# EasyEDA Pro project stm_boy_proj.epro, schematic gameconsole

## Sheets
1 Logic: Board Name: gameconsole; Create Date: 2026-05-28; Page Name: Logic; Schematic Name: gameconsole; Update Date: 2026-05-31
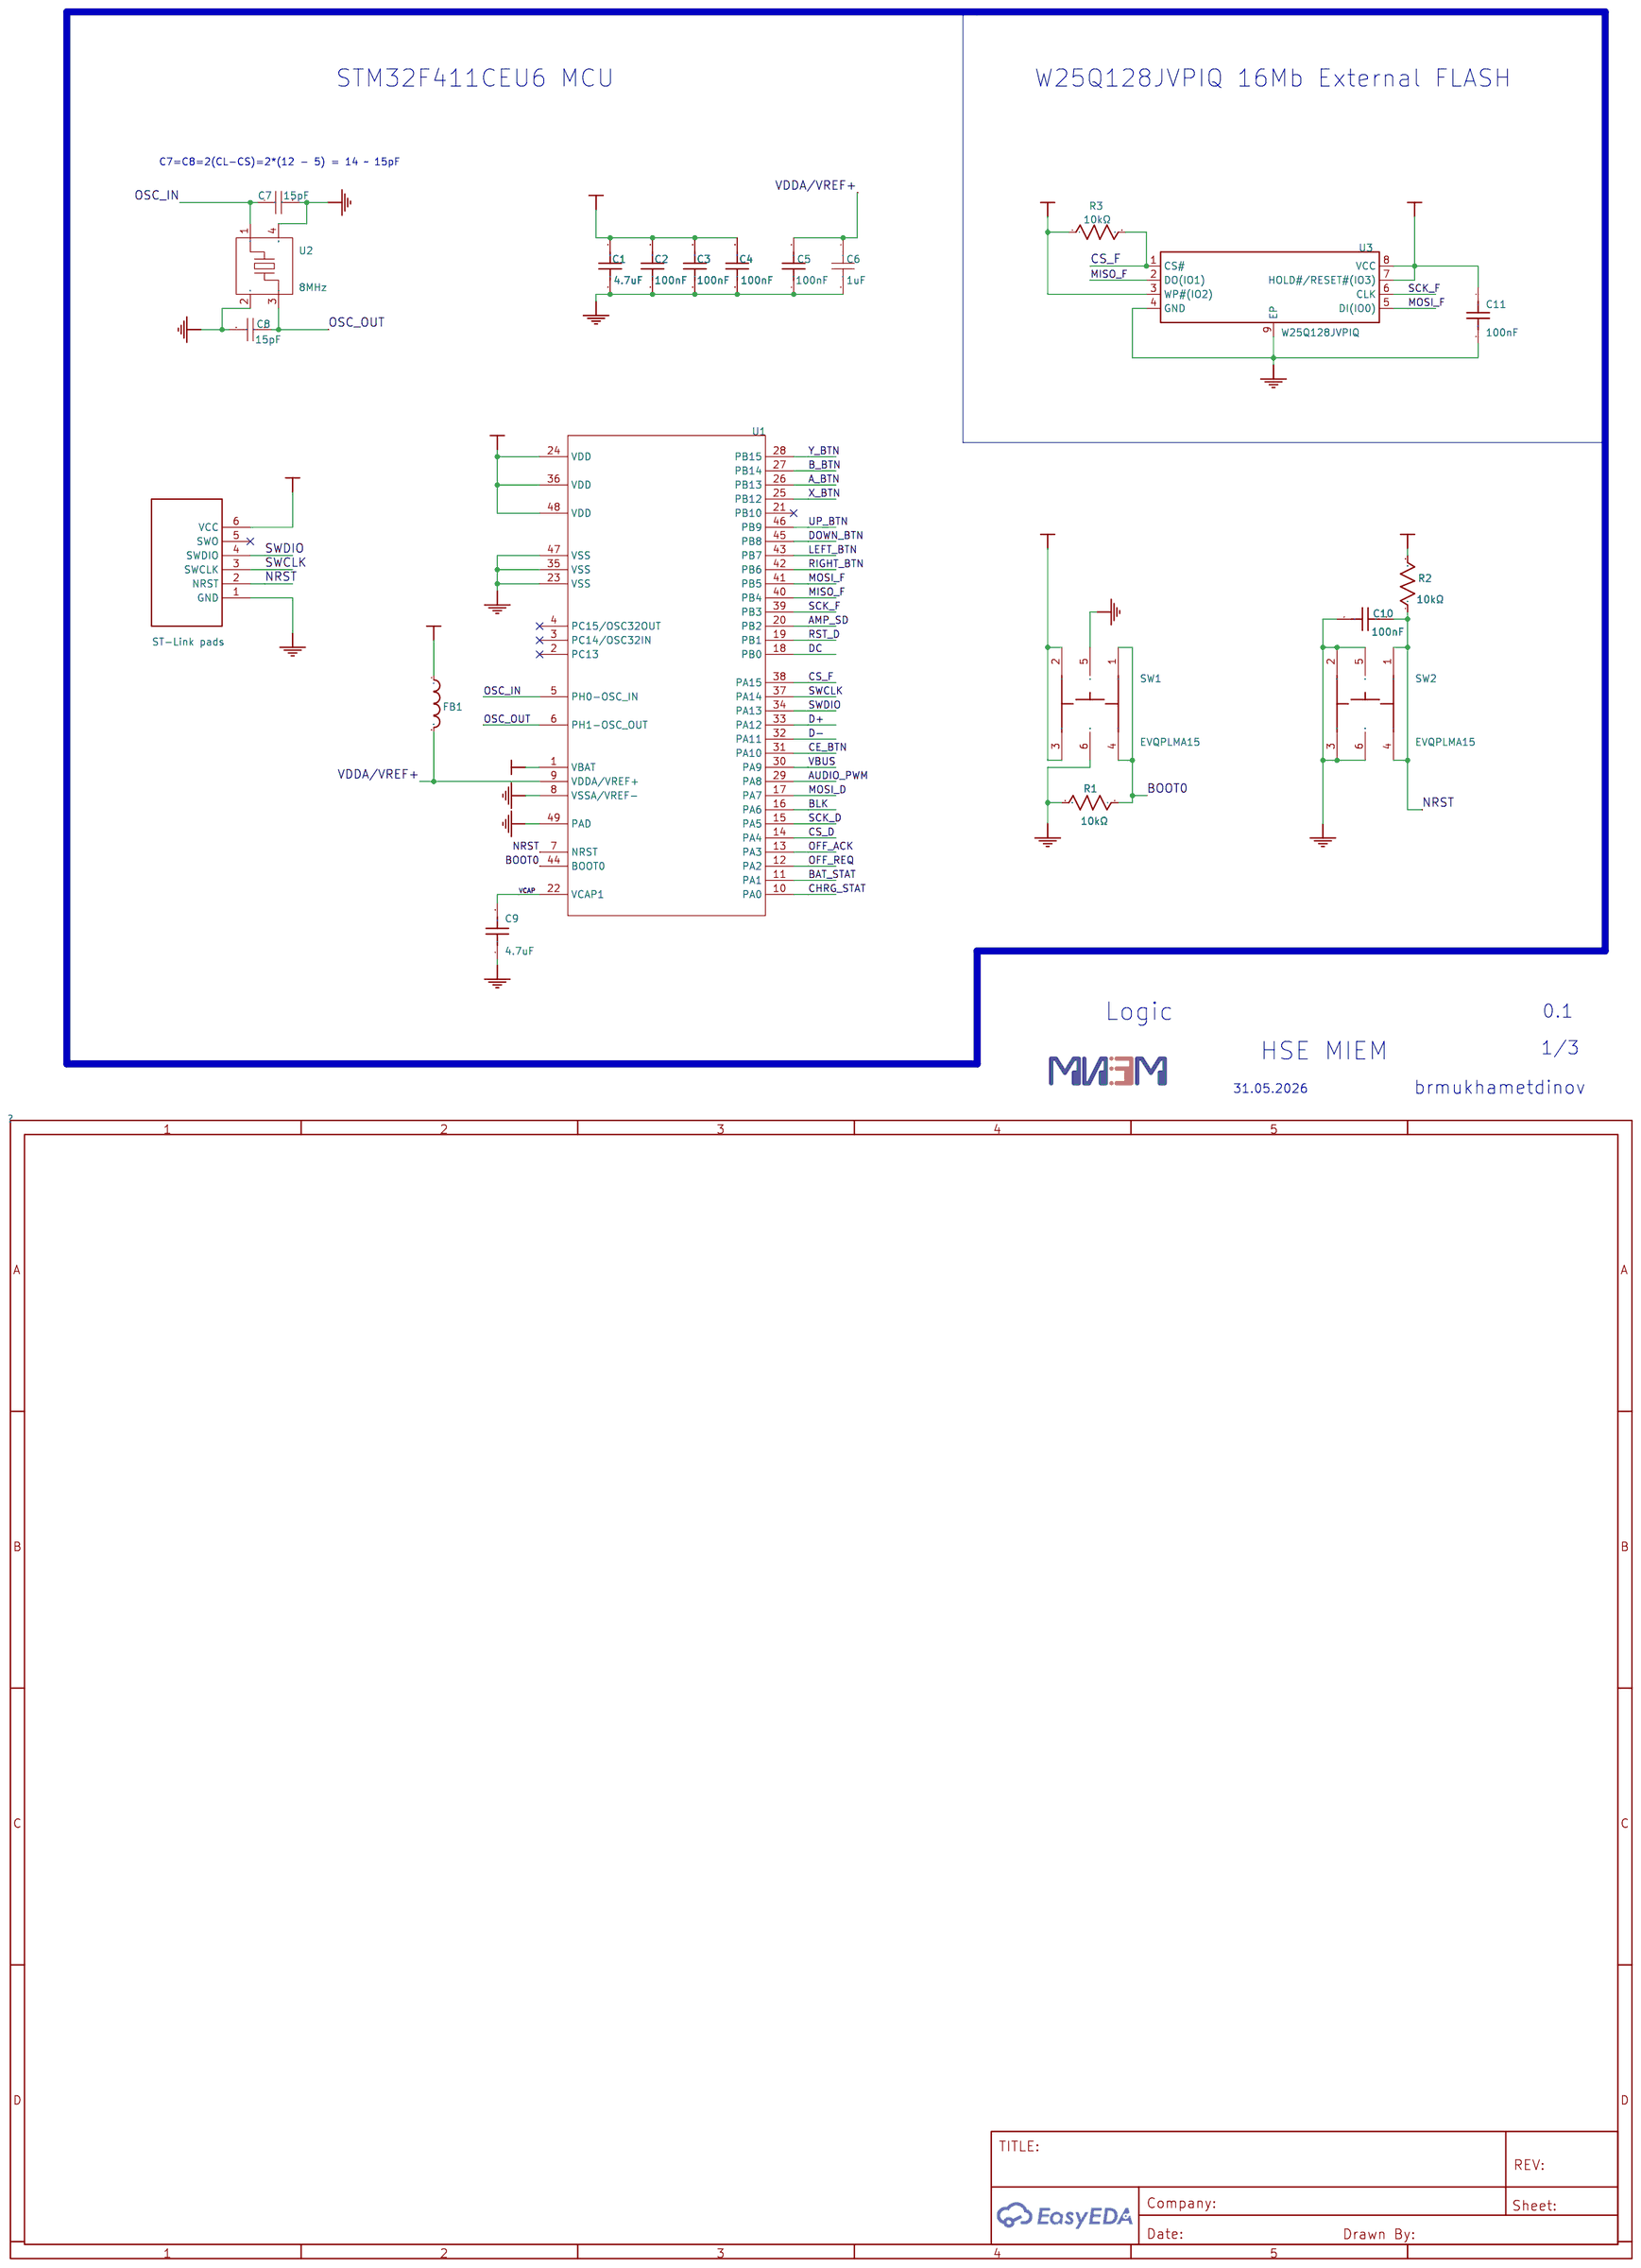
[diagram p0: Logic]
2 Power supply: Page Name: Power supply
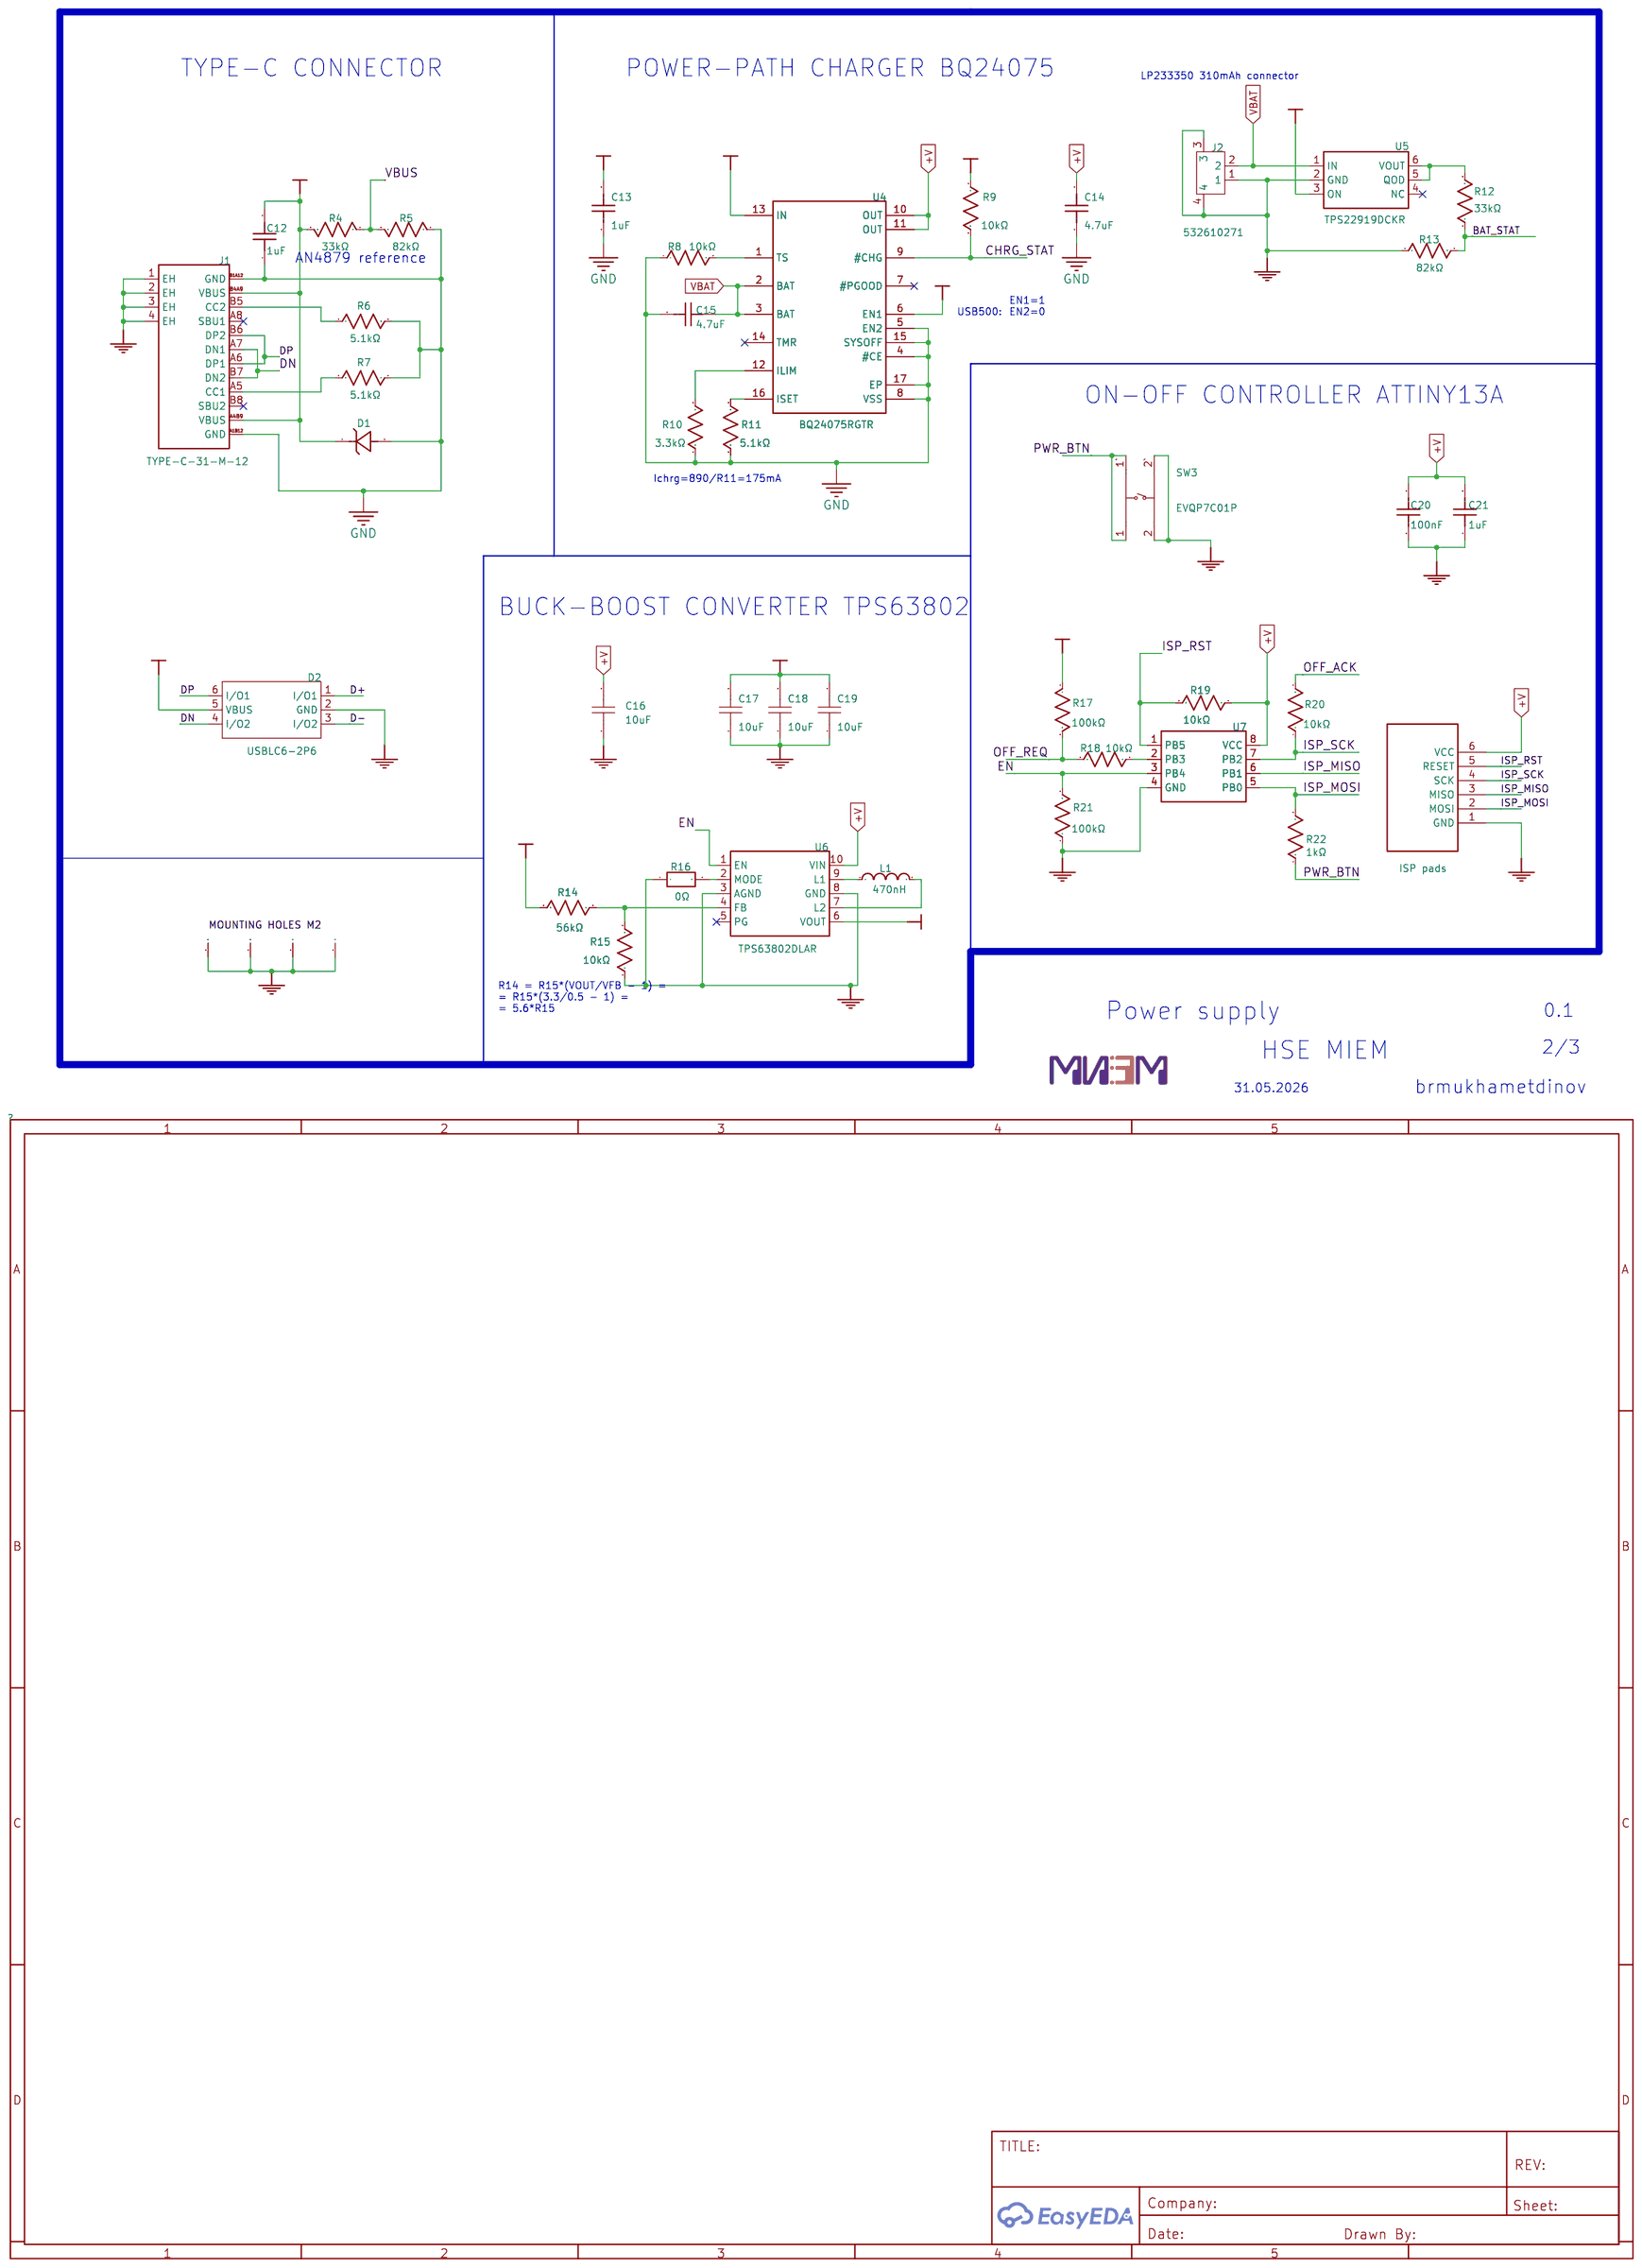
[diagram p1: Power supply]
3 Input/Output interfaces: Page Name: Input/Output interfaces; Project Name: gameconsole_2026-05-14_18-13-52; Add into BOM: yes; Company: HSE; Convert to PCB: yes; Date: 2026-04-27; Draw By: brmukhametdinov; REV: 0.5; Sheet: 1/4
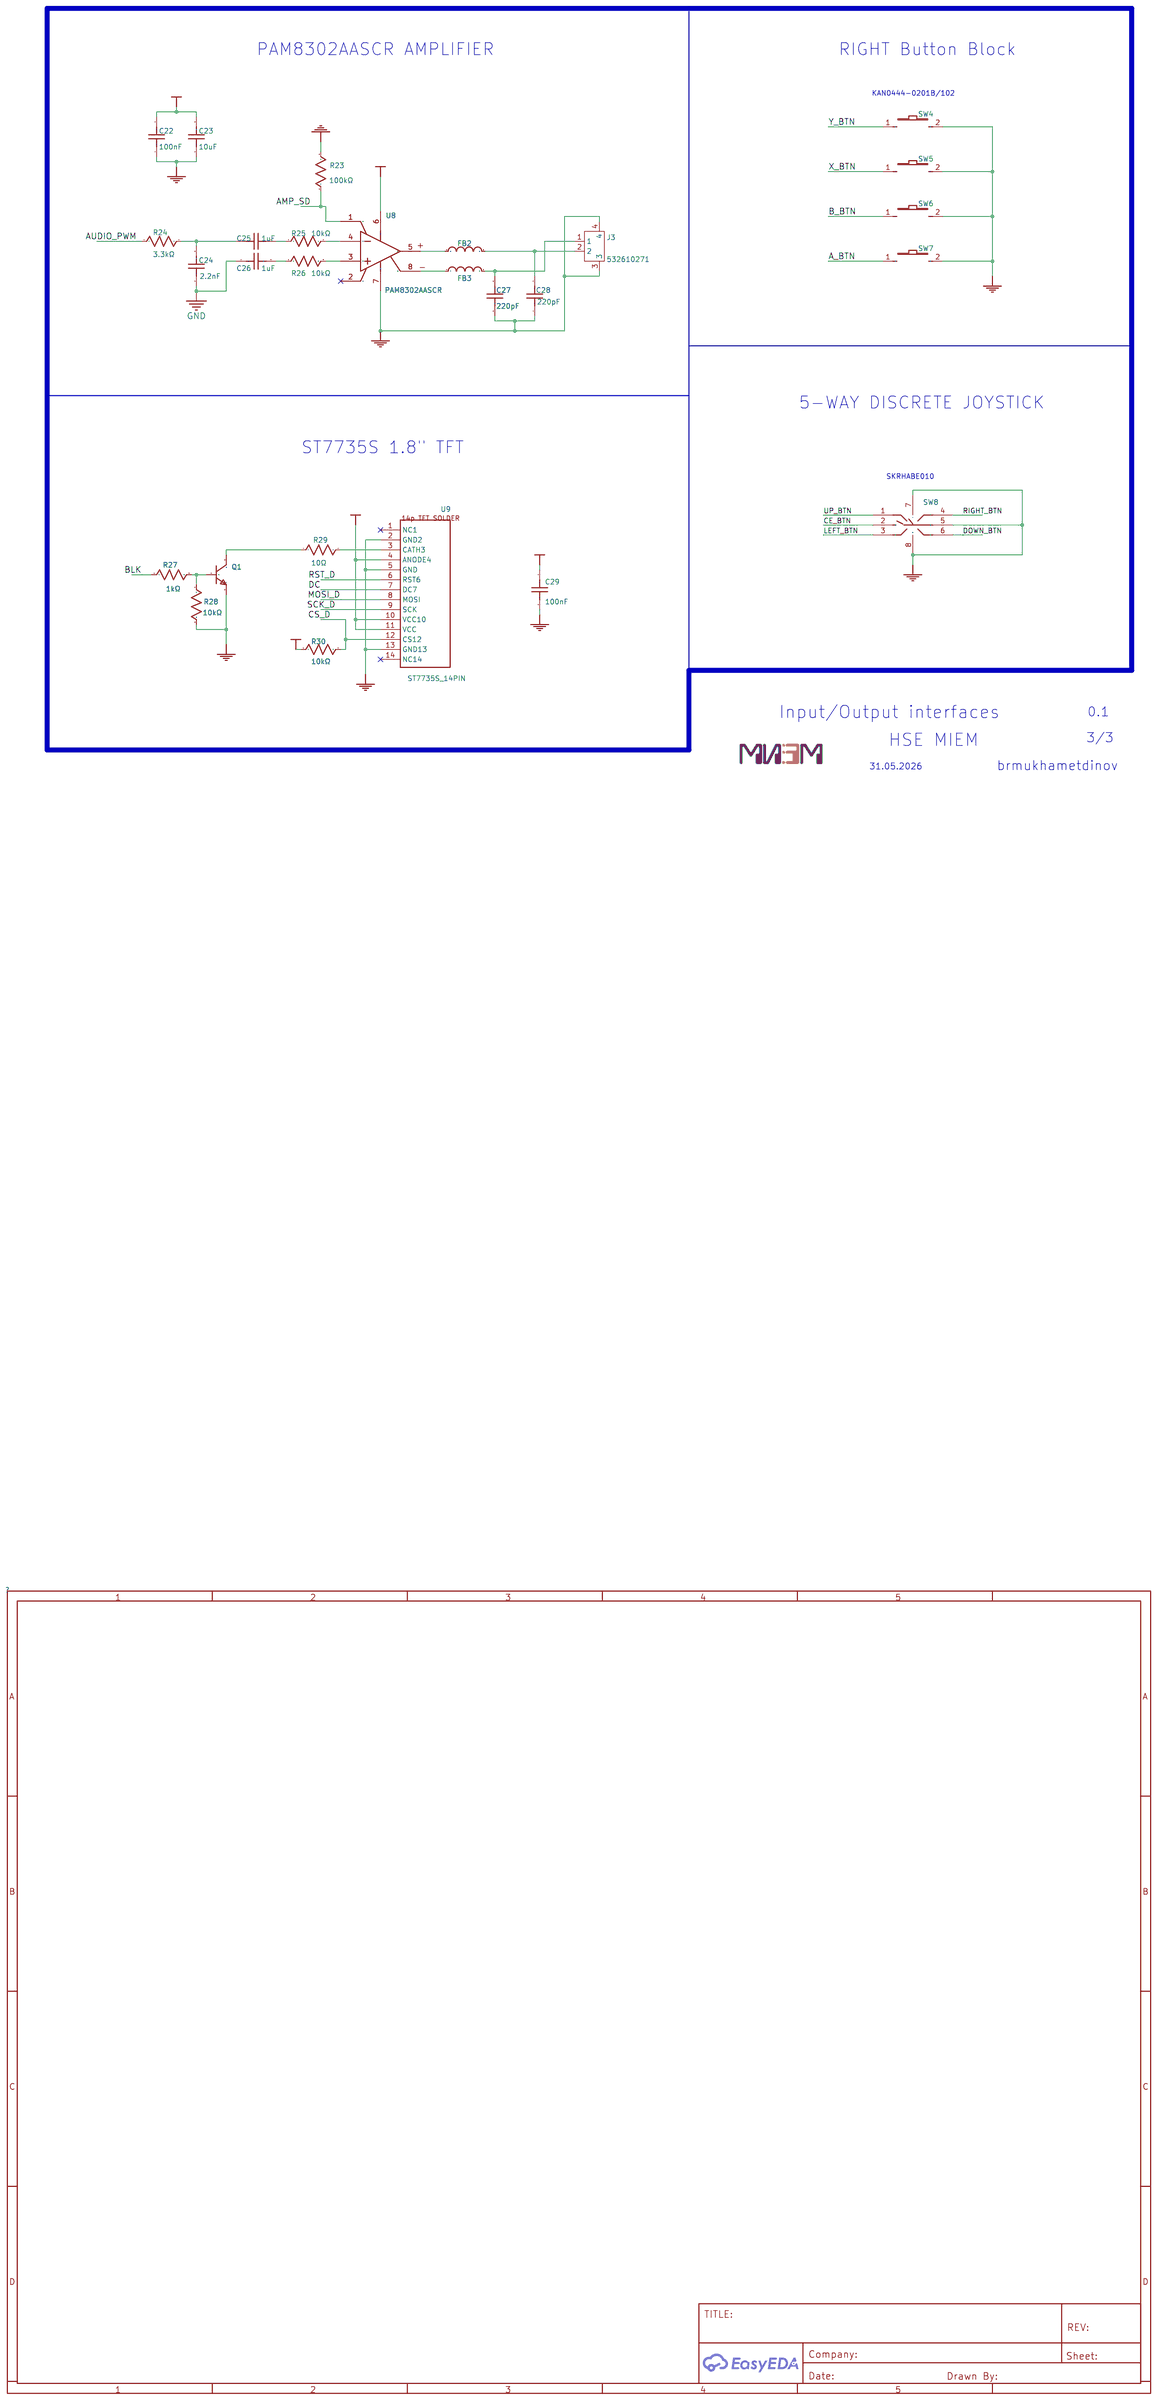
[diagram p2: Input/Output interfaces]

## Parts
sheet Input/Output interfaces
C22  100nF  [C0402]
C23  10uF  [C0603]
C24  2.2nF  [C0402]
C25  1uF  [C0603]
C26  1uF  [C0603]
C27  220pF  [C0402]
C28  220pF  [C0402]
C29  100nF  [C0402]
FB2  MPZ1608S101ATAH0  [L0603]
FB3  MPZ1608S101ATAH0  [L0603]
J3  532610271  [CONN-SMD_532610271]
Q1  S8050/J3Y/0.4  [SOT-23-3_L2.9-W1.3-P1.90-LS2.4-BR]
R23  100kΩ  [R0402]
R24  3.3kΩ  [R0402]
R25  10kΩ  [R0402]
R26  10kΩ  [R0402]
R27  1kΩ  [R0402]
R28  10kΩ  [R0402]
R29  10Ω  [R0805]
R30  10kΩ  [R0402]
SW4  KAN0444-0201B/102  [SW-SMD_KAN0444-0201B-102]
SW5  KAN0444-0201B/102  [SW-SMD_KAN0444-0201B-102]
SW6  KAN0444-0201B/102  [SW-SMD_KAN0444-0201B-102]
SW7  KAN0444-0201B/102  [SW-SMD_KAN0444-0201B-102]
SW8  SKRHABE010  [SW-SMD_SKRHABE010]
U8  PAM8302AASCR  [MSOP-8_L3.0-W3.0-P0.65-LS5.0-BL]
U9  ST7735S_14PIN  [NSP_TFT_1.77_128160_ST7735S_14PIN]
sheet Logic
C1  4.7uF  [C0603]
C2  100nF  [C0402]
C3  100nF  [C0402]
C4  100nF  [C0402]
C5  100nF  [C0402]
C6  1uF  [C0603]
C7  15pF  [C0402]
C8  15pF  [C0402]
C9  4.7uF  [C0603]
C10  100nF  [C0402]
C11  100nF  [C0402]
FB1  BLM15PX601SN1D  [L0402]
R1  10kΩ  [R0402]
R2  10kΩ  [R0402]
R3  10kΩ  [R0402]
SW1  EVQPLMA15  [KEY-SMD_6P-L4.9-4.9-P3.70]
SW2  EVQPLMA15  [KEY-SMD_6P-L4.9-4.9-P3.70]
U1  STM32F411CEU6  [UFQFPN-48_L7.0-W7.0-P0.50-BL-EP]
U2  8MHz  [CRYSTAL-SMD_4P-L3.2-W2.5-BL]
U3  W25Q128JVPIQ  [WSON-8_L5.0-W6.0-P1.27-BL-EP]
X1  ST-Link pads  [6-PIN HEADER SMALL 1.27MM]  (no BOM)
sheet Power supply
C12  1uF  [C0603]
C13  1uF  [C0603]
C14  4.7uF  [C0603]
C15  4.7uF  [C0603]
C16  10uF  [C0603]
C17  10uF  [C0603]
C18  10uF  [C0603]
C19  10uF  [C0603]
C20  100nF  [C0402]
C21  1uF  [C0603]
D1  ESDA7P60-1U1M  [DFN1610-2L_L1.6-W1.0-P1.10-RD]
D2  USBLC6-2P6  [SOT-666-6_L1.6-W1.2-P0.50-LS1.6-BL]
J1  TYPE-C-31-M-12  [USB-C_SMD-TYPE-C-31-M-12_1]
J2  532610271  [CONN-SMD_532610271]
L1  470nH  [IND-SMD_L4.4-W4.2_SPM4020T]
O1  MOUNTING HOLES M2  [MOUNTINGHOLE_2.2MM_M2_PAD_VIA]  (no BOM)
O2  MOUNTING HOLES M2  [MOUNTINGHOLE_2.2MM_M2_PAD_VIA]  (no BOM)
O3  MOUNTING HOLES M2  [MOUNTINGHOLE_2.2MM_M2_PAD_VIA]  (no BOM)
O4  MOUNTING HOLES M2  [MOUNTINGHOLE_2.2MM_M2_PAD_VIA]  (no BOM)
R4  33kΩ  [R0402]
R5  82kΩ  [R0402]
R6  5.1kΩ  [R0402]
R7  5.1kΩ  [R0402]
R8  10kΩ  [R0402]
R9  10kΩ  [R0402]
R10  3.3kΩ  [R0402]
R11  5.1kΩ  [R0402]
R12  33kΩ  [R0402]
R13  82kΩ  [R0402]
R14  56kΩ  [R0402]
R15  10kΩ  [R0402]
R16  0Ω  [R0603]
R17  100kΩ  [R0402]
R18  10kΩ  [R0402]
R19  10kΩ  [R0402]
R20  10kΩ  [R0402]
R21  100kΩ  [R0402]
R22  1kΩ  [R0402]
SW3  EVQP7C01P  [SW-SMD_EVQP7C01P]
U4  BQ24075RGTR  [QFN-16_L3.0-W3.0-P0.50-TL-EP1.7]
U5  TPS22919DCKR  [SC-70-6_L2.2-W1.3-P0.65-LS2.1-BR]
U6  TPS63802DLAR  [VSON-10_L3.0-W2.0-P0.50-TL]
U7  ATTINY13A-SSU  [SOIC-8_L4.9-W3.9-P1.27-LS6.0-BL]
X2  ISP pads  [6-PIN HEADER SMALL 1.27MM]  (no BOM)

## Library data of the parts
C10 C22 = CC0402KRX7R6BB104: Capacitance:100nF Tolerance:±10% Tolerance:±10% Voltage Rating:10V Temperature Coefficient:X7R; LCSC Part Name: 100nF ±10% 10V; Supplier Part: C309458; Manufacturer: YAGEO(国巨); Supplier Footprint: 0402; JLCPCB Part Class: Extended Part; Datasheet: https://item.szlcsc.com/datasheet/CC0402KRX7R6BB104/293074.html; Supplier: LCSC; Tolerance: ±10%; Voltage Rating: 10V; Temperature Coefficient: X7R; nameAlias: Value(F); Contributor: LCEDA_Lib; spicePre: C; spiceSymbolName: C_0603_US
C23 = GRM188Z71A106KA73D: Capacitance: Tolerance:±10% Tolerance:±10% Voltage Rated: Temperature Coefficient:; LCSC Part Name: 10uF ±10% 10V; Supplier Part: C2959727; Manufacturer: muRata(村田); Supplier Footprint: 0603; JLCPCB Part Class: Extended Part; Datasheet: https://atta.szlcsc.com/upload/public/pdf/source/20220328/6A4892B7E841253269A84FFE395E0578.pdf; Supplier: LCSC; Tolerance: ±10%; nameAlias: Value(F); Contributor: LCEDA_Lib; spicePre: C; spiceSymbolName: C_0603_US; Voltage Rating: 6.3V
C24 = CC0402JRX7R9BB222: Capacitance: Tolerance:±5% Tolerance:±5% Voltage Rated: Temperature Coefficient:; LCSC Part Name: 2.2nF ±5% 50V; Supplier Part: C513667; Manufacturer: YAGEO(国巨); Supplier Footprint: 0402; JLCPCB Part Class: Extended Part; Datasheet: https://atta.szlcsc.com/upload/public/pdf/source/20200415/C513667_43ACA5E3BCCDD816EC65E9B61132137F.pdf; Supplier: LCSC; Tolerance: ±5%; nameAlias: Value(F); Contributor: LCEDA_Lib; spicePre: C; spiceSymbolName: C_0603_US
C25 C26 = CL10B105KP8NNNC: Capacitance:1uF Tolerance:±10% Tolerance:±10% Voltage Rating:10V Temperature Coefficient:X7R; LCSC Part Name: 1uF ±10% 10V; Supplier Part: C95843; Manufacturer: SAMSUNG(三星); Supplier Footprint: 0603; JLCPCB Part Class: Extended Part; Datasheet: https://item.szlcsc.com/datasheet/CL10B105KP8NNNC/97047.html; Supplier: LCSC; Tolerance: ±10%; Voltage Rating: 10V; Temperature Coefficient: X7R; nameAlias: Value(F); Contributor: LCEDA_Lib; spicePre: C; spiceSymbolName: C_0603_US
C27 C28 = CC0402FRNPO9BN221: Capacitance: Tolerance:±1% Tolerance:±1% Voltage Rated: Temperature Coefficient:; LCSC Part Name: 220pF ±1% 50V; Supplier Part: C326765; Manufacturer: YAGEO(国巨); Supplier Footprint: 0402; JLCPCB Part Class: Extended Part; Datasheet: https://atta.szlcsc.com/upload/public/pdf/source/20191125/C354976_4A9AE911FA5758D8C0A36AE6394FD4D7.pdf; Supplier: LCSC; Tolerance: ±1%; nameAlias: Value(F); Contributor: LCEDA_Lib; spicePre: C; spiceSymbolName: C_0603_US
C11 C29 = CC0402KRX7R6BB104: Capacitance:100nF Tolerance:±10% Tolerance:±10% Voltage Rating:10V Temperature Coefficient:X7R; LCSC Part Name: 100nF ±10% 10V; Supplier Part: C309458; Manufacturer: YAGEO(国巨); Supplier Footprint: 0402; JLCPCB Part Class: Extended Part; Datasheet: https://item.szlcsc.com/datasheet/CC0402KRX7R6BB104/293074.html; Supplier: LCSC; Tolerance: ±10%; Voltage Rating: 10V; Temperature Coefficient: X7R; nameAlias: Value; Contributor: lcsc; spicePre: C; spiceSymbolName: CC0603ZRY5V7BB104
FB2 FB3 = MPZ1608S101ATAH0: Impedance @ Frequency:100Ω@100MHz Tolerance:±25% Tolerance:±25% DC Resistance(DCR):30mΩ Current Rating:3A Number of Circuits:1 Operating Temperature:-55℃~+125℃ Operating Temperature:-55℃~+125℃; LCSC Part Name: 单路 0603磁珠 阻抗100Ω@100MHz; Supplier Part: C107332; Manufacturer: TDK; Supplier Footprint: 0603; JLCPCB Part Class: Extended Part; Datasheet: https://item.szlcsc.com/datasheet/MPZ1608S101ATAH0/108551.html; Supplier: LCSC; Impedance @ Frequency: 100Ω@100MHz; Tolerance: ±25%; DC Resistance(DCR): 30mΩ; Current Rating: 3A; Number of Circuits: 1; Operating Temperature: -55℃~+125℃; nameAlias: Value(H); Contributor: LCEDA_Lib; spicePre: L; spiceSymbolName: L0603_US
J2 J3 = 532610271: Pins Structure:1x2P Pitch:1.25mm Mounting Type:Horizontal attachment Reference Series:PicoBlade(MX 1.25) Number of Pins:2P Number of Rows:1 Number of PINs Per Row:2 Row Spacing:- Current Rating:1A Contact Material:Phosphor Bronze Contact Plating:Tin Opera; LCSC Part Name: 1x2P 间距:1.25mm 卧贴 系列:PicoBlade(MX 1.25); Supplier Part: C189700; Manufacturer: MOLEX; Supplier Footprint: SMD,P=1.25mm; JLCPCB Part Class: Extended Part; Datasheet: https://www.molex.com/content/dam/molex/molex-dot-com/products/automated/en-us/salesdrawingpdf/532/53261/532610271_sd.pdf?inline; Supplier: LCSC; Pins Structure: 1x2P; Pitch: 1.25mm; Mounting Type: Horizontal attachment; Reference Series: PicoBlade(MX 1.25); Number of Pins: 2P; Number of Rows: 1; Number of PINs Per Row: 2; Current Rating: 1A; Contact Material: Phosphor Bronze; Contact Plating: Tin; Operating Temperature: -40℃~+105℃; Voltage Rating: 125V; Plastic Material: Fiberglass Reinforced PA; Flame Retardant Rating: UL94V-0; Supplementary Features: Auxiliary soldering legs; Color: White; Z-Height of the Board: 3.4mm; X-Length of Bottom Edge on Board (Spacing Line): 7.65mm; Y-Width of Bottom Edge on Board: 5.2mm
Q1 = S8050/J3Y/0.4: type:NPN Current - Collector(Ic):500mA Collector - Emitter Voltage VCEO:25V Pd - Power Dissipation:225mW DC Current Gain:400 DC Current Gain:400 Transition frequency(fT):100MHz Current - Collector Cutoff:100nA Vce Saturation(VCE(sat)):600mV Operating Temp; LCSC Part Name: 电压:25V 电流:500mA; Supplier Part: C5143141; Manufacturer: MOT(仁懋); Supplier Footprint: SOT-23; JLCPCB Part Class: Extended Part; Datasheet: https://item.szlcsc.com/datasheet/S8050%252FJ3Y%252F0.4/5761459.html; Supplier: LCSC; type: NPN; Current - Collector(Ic): 500mA; Collector - Emitter Voltage VCEO: 25V; Pd - Power Dissipation: 225mW; DC Current Gain: 400; Transition frequency(fT): 100MHz; Current - Collector Cutoff: 100nA; Vce Saturation(VCE(sat)): 600mV; Operating Temperature: -55℃~+150℃; Emitter-Base Voltage(Vebo): 5V; Number: 1 NPN; Contributor: lcsc; spicePre: Q
R17 R21 R23 = RC0402FR-07100KL: Type:Thick Film Resistor Resistance:100kΩ Tolerance:±1% Tolerance:±1% Power(Watts):62.5mW Voltage-Supply(Max):50V Temperature Coefficient:±100ppm/℃ Temperature Coefficient:±100ppm/℃ Operating Temperature:-55℃~+155℃ Operating Temperature:-55℃~+155℃; LCSC Part Name: 厚膜电阻 100kΩ ±1% 62.5mW; Supplier Part: C60491; Manufacturer: YAGEO(国巨); Supplier Footprint: 0402; JLCPCB Part Class: Extended Part; Datasheet: https://item.szlcsc.com/datasheet/RC0402FR-07100KL/61543.html; Supplier: LCSC; Type: Thick Film Resistor; Tolerance: ±1%; Power(Watts): 62.5mW; Voltage-Supply(Max): 50V; Temperature Coefficient: ±100ppm/℃; Operating Temperature: -55℃~+155℃; nameAlias: Value(Ω); Contributor: LCEDA_Lib; spicePre: R; spiceSymbolName: R_0603_US
R10 R24 = RC0402FR-073K3L: Type:Thick Film Resistor Resistance:3.3kΩ Tolerance:±1% Tolerance:±1% Power(Watts):62.5mW Voltage-Supply(Max):50V Temperature Coefficient:±100ppm/℃ Temperature Coefficient:±100ppm/℃ Operating Temperature:-55℃~+155℃ Operating Temperature:-55℃~+155℃; LCSC Part Name: 厚膜电阻 3.3kΩ ±1% 62.5mW; Supplier Part: C137992; Manufacturer: YAGEO(国巨); Supplier Footprint: 0402; JLCPCB Part Class: Extended Part; Datasheet: https://item.szlcsc.com/datasheet/RC0402FR-073K3L/149308.html; Supplier: LCSC; Type: Thick Film Resistor; Tolerance: ±1%; Power(Watts): 62.5mW; Voltage-Supply(Max): 50V; Temperature Coefficient: ±100ppm/℃; Operating Temperature: -55℃~+155℃; nameAlias: Value(Ω); Contributor: LCEDA_Lib; spicePre: R; spiceSymbolName: R_0603_US
R1-R3 R8 R9 R15 R18-R20 R25 R26 R28 R30 = RT0402BRD0710KL: Type:Thin Film Resistor Resistance:10kΩ Tolerance:±0.1% Tolerance:±0.1% Power(Watts):62.5mW Voltage-Supply(Max):50V Temperature Coefficient:±25ppm/℃ Temperature Coefficient:±25ppm/℃ Operating Temperature:-55℃~+155℃ Operating Temperature:-55℃~+155℃; LCSC Part Name: 薄膜电阻 10kΩ ±0.1% 62.5mW; Supplier Part: C190095; Manufacturer: YAGEO(国巨); Supplier Footprint: 0402; JLCPCB Part Class: Extended Part; Datasheet: https://item.szlcsc.com/datasheet/RT0402BRD0710KL/208478.html; Supplier: LCSC; Type: Thin Film Resistor; Tolerance: ±0.1%; Power(Watts): 62.5mW; Voltage-Supply(Max): 50V; Temperature Coefficient: ±25ppm/℃; Operating Temperature: -55℃~+155℃; nameAlias: Value(Ω); Contributor: LCEDA_Lib; spicePre: R; spiceSymbolName: R_0603_US
R22 R27 = RC0402FR-071KL: Type:Thick Film Resistor Resistance:1kΩ Tolerance:±1% Tolerance:±1% Power(Watts):62.5mW Voltage-Supply(Max):50V Temperature Coefficient:±100ppm/℃ Temperature Coefficient:±100ppm/℃ Operating Temperature:-55℃~+155℃ Operating Temperature:-55℃~+155℃; LCSC Part Name: 厚膜电阻 1kΩ ±1% 62.5mW; Supplier Part: C106235; Manufacturer: YAGEO(国巨); Supplier Footprint: 0402; JLCPCB Part Class: Extended Part; Datasheet: https://item.szlcsc.com/datasheet/RC0402FR-071KL/107450.html; Supplier: LCSC; Type: Thick Film Resistor; Tolerance: ±1%; Power(Watts): 62.5mW; Voltage-Supply(Max): 50V; Temperature Coefficient: ±100ppm/℃; Operating Temperature: -55℃~+155℃; nameAlias: Value(Ω); Contributor: LCEDA_Lib; spicePre: R; spiceSymbolName: R_0603_US
R29 = RC0805FR-0710RL: Type:Thick Film Resistor Resistance:10Ω Tolerance:±1% Tolerance:±1% Power(Watts):125mW Voltage-Supply(Max):150V Temperature Coefficient:±200ppm/℃ Temperature Coefficient:±200ppm/℃ Operating Temperature:-55℃~+155℃ Operating Temperature:-55℃~+155℃; LCSC Part Name: 厚膜电阻 10Ω ±1% 125mW; Supplier Part: C96347; Manufacturer: YAGEO(国巨); Supplier Footprint: 0805; JLCPCB Part Class: Extended Part; Datasheet: https://item.szlcsc.com/datasheet/RC0805FR-0710RL/97551.html; Supplier: LCSC; Type: Thick Film Resistor; Tolerance: ±1%; Power(Watts): 125mW; Voltage-Supply(Max): 150V; Temperature Coefficient: ±200ppm/℃; Operating Temperature: -55℃~+155℃; nameAlias: Value(Ω); Contributor: LCEDA_Lib; spicePre: R; spiceSymbolName: R_0603_US
SW4-SW7 = KAN0444-0201B/102: Circuit:SPST Actuator Style:Round Button Mounting Style:Brick nogging Switch Length:4mm Switch Width:3mm Switch Height:2mm Contact Current:50mA Voltage Rating (DC):12V With Lamp:- Mechanical Life:-; LCSC Part Name: 4*3*2mm 立贴 轻触开关; Supplier Part: C231644; Manufacturer: GANGYUAN(港源); Supplier Footprint: SMD; JLCPCB Part Class: Extended Part; Datasheet: https://atta.szlcsc.com/upload/public/pdf/source/20180622/C231644_8E779A5E99ACC98584838CDB900BEA24.pdf; Supplier: LCSC; Circuit: SPST; Actuator Style: Round Button; Mounting Style: Brick nogging; Switch Length: 4mm; Switch Width: 3mm; Switch Height: 2mm; Contact Current: 50mA; Voltage Rating (DC): 12V; Contributor: LCSC; spicePre: S
SW8 = SKRHABE010: Supplier Part: C139794; Manufacturer: ALPSALPINE(阿尔卑斯阿尔派); Supplier Footprint: SMD-8P,7.5x7.5mm; JLCPCB Part Class: Extended Part; Datasheet: https://atta.szlcsc.com/upload/public/pdf/source/20171113/C139794_15105612668951115728.pdf; Supplier: LCSC; Contributor: LCSC; spicePre: S
U8 = PAM8302AASCR: Supplier: LCSC; Manufacturer: DIODES(美台); Supplier Part: C113367; JLCPCB Part Class: Extended Part; spicePre: U
U9 = ST7735S_14PIN: Supplier: Aliexpres; Contributor: donydar; spicePre: T; Check: false
C1 C9 = GRM188Z71C475KE21D: Capacitance:4.7uF Tolerance:±10% Tolerance:±10% Voltage Rating:16V Temperature Coefficient:X7R; LCSC Part Name: 4.7uF ±10% 16V; Supplier Part: C389010; Manufacturer: muRata(村田); Supplier Footprint: 0603; JLCPCB Part Class: Extended Part; Datasheet: https://item.szlcsc.com/datasheet/GRM188Z71C475KE21D/364359.html; Supplier: LCSC; Tolerance: ±10%; Voltage Rating: 16V; Temperature Coefficient: X7R; nameAlias: Value(F); Contributor: LCEDA_Lib; spicePre: C; spiceSymbolName: C_0603_US
C2-C5 C20 = CC0402KRX7R6BB104: Capacitance:100nF Tolerance:±10% Tolerance:±10% Voltage Rating:10V Temperature Coefficient:X7R; LCSC Part Name: 100nF ±10% 10V; Supplier Part: C309458; Manufacturer: YAGEO(国巨); Supplier Footprint: 0402; JLCPCB Part Class: Extended Part; Datasheet: https://item.szlcsc.com/datasheet/CC0402KRX7R6BB104/293074.html; Supplier: LCSC; Tolerance: ±10%; Voltage Rating: 10V; Temperature Coefficient: X7R; nameAlias: Value; spicePre: C; spiceSymbolName: GRM155R71C104KA88D
C6 = CL10B105KP8NNNC: Capacitance:1uF Tolerance:±10% Tolerance:±10% Voltage Rating:10V Temperature Coefficient:X7R; LCSC Part Name: 1uF ±10% 10V; Supplier Part: C95843; Manufacturer: SAMSUNG(三星); Supplier Footprint: 0603; JLCPCB Part Class: Extended Part; Datasheet: https://item.szlcsc.com/datasheet/CL10B105KP8NNNC/97047.html; Supplier: LCSC; Tolerance: ±10%; Voltage Rating: 10V; Temperature Coefficient: X7R
C7 C8 = GRM1555C1H150JA01D: Capacitance:15pF Tolerance:±5% Tolerance:±5% Voltage Rating:50V Temperature Coefficient:C0G; LCSC Part Name: 15pF ±5% 50V; Supplier Part: C76950; Manufacturer: muRata(村田); Supplier Footprint: 0402; JLCPCB Part Class: Extended Part; Datasheet: https://item.szlcsc.com/datasheet/GRM1555C1H150JA01D/78077.html; Supplier: LCSC; Tolerance: ±5%; Voltage Rating: 50V; Temperature Coefficient: C0G
FB1 = BLM15PX601SN1D: Impedance @ Frequency:600Ω@100MHz Tolerance:±25% Tolerance:±25% DC Resistance(DCR):230mΩ Current Rating:900mA Number of Circuits:1 Operating Temperature:-55℃~+125℃ Operating Temperature:-55℃~+125℃; LCSC Part Name: 单路 0402磁珠 阻抗600Ω@100MHz; Supplier Part: C160977; Manufacturer: muRata(村田); Supplier Footprint: 0402; JLCPCB Part Class: Extended Part; Datasheet: https://item.szlcsc.com/datasheet/BLM15PX601SN1D/172358.html; Supplier: LCSC; Impedance @ Frequency: 600Ω@100MHz; Tolerance: ±25%; DC Resistance(DCR): 230mΩ; Current Rating: 900mA; Number of Circuits: 1; Operating Temperature: -55℃~+125℃; nameAlias: Value; spicePre: L; spiceSymbolName: BLM18AG601SN1D
SW1 SW2 = EVQPLMA15: Supplier: LCSC; Manufacturer: PANASONIC(松下); Supplier Part: C128538; JLCPCB Part Class: Extended Part; Contributor: LCSC; spicePre: S
U1 = STM32F411CEU6: CPU Core:ARM-M4 CPU Maximum Speed:100MHz Program Storage Size:512KB Program Memory Type:FLASH Number of I/O:36 ADC (Bit):12bit Voltage - Supply:1.7V~3.6V Voltage - Supply:1.7V~3.6V Applications:-; LCSC Part Name: 带DSP和FPU的高性能基本型系列ARM Cortex-M4 MCU，具有512 KB Flash、100 MHz CPU和ART加速器; Supplier Part: C60420; Manufacturer: ST(意法半导体); Supplier Footprint: UFQFPN-48(7x7); JLCPCB Part Class: Extended Part; Datasheet: https://item.szlcsc.com/datasheet/STM32F411CEU6/61472.html; Supplier: LCSC; CPU Core: ARM-M4; CPU Maximum Speed: 100MHz; Program Storage Size: 512KB; Program Memory Type: FLASH; Number of I/O: 36; ADC (Bit): 12bit; Voltage - Supply: 1.7V~3.6V
U2 = X32258MOB4SI: Type:Crystal Oscillator Frequency:8MHz Normal temperature Frequency Tolerance:±10ppm Normal temperature Frequency Tolerance:±10ppm Load Capacitance:12pF Frequency Stability:±20ppm Frequency Stability:±20ppm Equivalent Series Resistance(ESR):150Ω Operating; LCSC Part Name: YSX321SL 8MHZ 4P 3225 12PF ±10PPM -40~85℃ (±20PPM); Supplier Part: C2682775; Manufacturer: YXC(扬兴晶振); Supplier Footprint: SMD3225-4P; JLCPCB Part Class: Extended Part; Datasheet: https://item.szlcsc.com/datasheet/X32258MOB4SI/2777872.html; Supplier: LCSC; Type: Crystal Oscillator; Normal temperature Frequency Tolerance: ±10ppm; Load Capacitance: 12pF; Frequency Stability: ±20ppm; Equivalent Series Resistance(ESR): 150Ω; Operating Temperature: -40℃~+85℃; nameAlias: Value; Contributor: LCSC; spicePre: X; spiceSymbolName: DSX321G 8MHz
U3 = W25Q128JVPIQ: Supplier: LCSC; Supplier Part: C2803379; Manufacturer: Winbond(华邦); JLCPCB Part Class: Extended Part; Contributor: LCSC; spicePre: U
X1 = ST-Link pads: Contributor: muhametdinovbulat28; spicePre: U
C12 = CL10B105KP8NNNC: Capacitance:1uF Tolerance:±10% Tolerance:±10% Voltage Rating:10V Temperature Coefficient:X7R; LCSC Part Name: 1uF ±10% 10V; Supplier Part: C95843; Manufacturer: SAMSUNG(三星); Supplier Footprint: 0603; JLCPCB Part Class: Extended Part; Datasheet: https://item.szlcsc.com/datasheet/CL10B105KP8NNNC/97047.html; Supplier: LCSC; Tolerance: ±10%; Voltage Rating: 10V; Temperature Coefficient: X7R; nameAlias: Value; Contributor: lcsc; spicePre: U; spiceSymbolName: 0603DS106M100NT
C13 = CL10B105KP8NNNC: Capacitance:1uF Tolerance:±10% Tolerance:±10% Voltage Rating:10V Temperature Coefficient:X7R; LCSC Part Name: 1uF ±10% 10V; Supplier Part: C95843; Manufacturer: SAMSUNG(三星); Supplier Footprint: 0603; JLCPCB Part Class: Extended Part; Datasheet: https://item.szlcsc.com/datasheet/CL10B105KP8NNNC/97047.html; Supplier: LCSC; Tolerance: ±10%; Voltage Rating: 10V; Temperature Coefficient: X7R; nameAlias: Value; Contributor: lcsc; spicePre: C; spiceSymbolName: HGC0805R5476M100NSLJ
C14 C15 = GRM188Z71C475KE21D: Capacitance:4.7uF Tolerance:±10% Tolerance:±10% Voltage Rating:16V Temperature Coefficient:X7R; LCSC Part Name: 4.7uF ±10% 16V; Supplier Part: C389010; Manufacturer: muRata(村田); Supplier Footprint: 0603; JLCPCB Part Class: Extended Part; Datasheet: https://item.szlcsc.com/datasheet/GRM188Z71C475KE21D/364359.html; Supplier: LCSC; Tolerance: ±10%; Voltage Rating: 16V; Temperature Coefficient: X7R; nameAlias: Value; spicePre: C; spiceSymbolName: CL21F475ZOFNNNE
C16 = GRM188Z71A106KA73D: Capacitance: Tolerance:±10% Tolerance:±10% Voltage Rated: Temperature Coefficient:; LCSC Part Name: 10uF ±10% 10V; Supplier Part: C2959727; Manufacturer: muRata(村田); Supplier Footprint: 0603; JLCPCB Part Class: Extended Part; Datasheet: https://atta.szlcsc.com/upload/public/pdf/source/20220328/6A4892B7E841253269A84FFE395E0578.pdf; Supplier: LCSC; Tolerance: ±10%; Voltage Rating: 6.3V
C17-C19 = GRM188Z71A106KA73D: Capacitance: Tolerance:±10% Tolerance:±10% Voltage Rated: Temperature Coefficient:; LCSC Part Name: 10uF ±10% 10V; Supplier Part: C2959727; Manufacturer: muRata(村田); Supplier Footprint: 0603; JLCPCB Part Class: Extended Part; Datasheet: https://atta.szlcsc.com/upload/public/pdf/source/20220328/6A4892B7E841253269A84FFE395E0578.pdf; Supplier: LCSC; Tolerance: ±10%
C21 = CL10B105KP8NNNC: Capacitance:1uF Tolerance:±10% Tolerance:±10% Voltage Rating:10V Temperature Coefficient:X7R; LCSC Part Name: 1uF ±10% 10V; Supplier Part: C95843; Manufacturer: SAMSUNG(三星); Supplier Footprint: 0603; JLCPCB Part Class: Extended Part; Datasheet: https://item.szlcsc.com/datasheet/CL10B105KP8NNNC/97047.html; Supplier: LCSC; Tolerance: ±10%; Voltage Rating: 10V; Temperature Coefficient: X7R; nameAlias: Value; Contributor: lcsc; spicePre: C; spiceSymbolName: TCC0603X5R105M160CT
D1 = ESDA7P60-1U1M_C7202956: Supplier Part: C7202956; Manufacturer: TECH PUBLIC(台舟); Supplier Footprint: DFN1610-2; JLCPCB Part Class: Extended Part; Datasheet: https://atta.szlcsc.com/upload/public/pdf/source/20230621/0A7E2A8EA5FAD3C7FD18B28B3829338D.pdf; Supplier: LCSC; Contributor: lcsc; spicePre: U
D2 = USBLC6-2P6: polarity:Unidirectional Reverse Stand-Off Voltage (Vrwm):5V Maximum Clamping Voltage:14V Peak Pulse Current (Ipp):5.5A Peak Pulse Power Dissipation (Ppp):80W Breakdown Voltage:6V Reverse Leakage Current (Ir):80nA Number of Lines:Dual channel Operating Tem; LCSC Part Name: MSL=3; Supplier Part: C2827693; Manufacturer: TECH PUBLIC(台舟); Supplier Footprint: SOT-666-6; JLCPCB Part Class: Extended Part; Datasheet: https://atta.szlcsc.com/upload/public/pdf/source/20210810/36353A9194EA9F4E33F8AE18BE051AEA.pdf; Supplier: LCSC; polarity: Unidirectional; Reverse Stand-Off Voltage (Vrwm): 5V; Maximum Clamping Voltage: 14V; Peak Pulse Current (Ipp): 5.5A; Peak Pulse Power Dissipation (Ppp): 80W; Breakdown Voltage: 6V; Reverse Leakage Current (Ir): 80nA; Number of Lines: Dual channel; Operating Temperature: -55℃~+125℃; level of protection: IEC 61000-4-2; Type: ESD
J1 = TYPE-C-31-M-12: Supplier: LCSC; Supplier Part: C165948; Manufacturer: 韩国韩荣; JLCPCB Part Class: Extended Part; Contributor: LCSC; spicePre: U
L1 = SPM4020T-R47M-LR: Inductance: Tolerance:±20% Tolerance:±20% Rated Current: Saturation Current (Isat):14.1A DC Resistance (DCR): Type:- Ratings:-; LCSC Part Name: 470nH ±20% 14.1A; Supplier Part: C695602; Manufacturer: TDK; Supplier Footprint: SMD,4.1x4.4mm; JLCPCB Part Class: Extended Part; Datasheet: https://atta.szlcsc.com/upload/public/pdf/source/20191009/C434834_5BD760480D7529BFC2FA775BA8751664.pdf; Supplier: LCSC; Tolerance: ±20%; Saturation Current (Isat): 14.1A; Contributor: LCSC; nameAlias: Value; spicePre: L
O1-O4 = MOUNTINGHOLE_2.2MM: Contributor: Marlon Vinicius; spicePre: O
R4 R12 = RC0402FR-0733KL: Type:Thick Film Resistor Resistance:33kΩ Tolerance:±1% Tolerance:±1% Power(Watts):62.5mW Voltage-Supply(Max):50V Temperature Coefficient:±100ppm/℃ Temperature Coefficient:±100ppm/℃ Operating Temperature:-55℃~+155℃ Operating Temperature:-55℃~+155℃; LCSC Part Name: 厚膜电阻 33kΩ ±1% 62.5mW; Supplier Part: C138003; Manufacturer: YAGEO(国巨); Supplier Footprint: 0402; JLCPCB Part Class: Extended Part; Datasheet: https://item.szlcsc.com/datasheet/RC0402FR-0733KL/149319.html; Supplier: LCSC; Type: Thick Film Resistor; Tolerance: ±1%; Power(Watts): 62.5mW; Voltage-Supply(Max): 50V; Temperature Coefficient: ±100ppm/℃; Operating Temperature: -55℃~+155℃; nameAlias: Value(Ω); Contributor: LCEDA_Lib; spicePre: R; spiceSymbolName: R_0603_US
R5 R13 = RC0402FR-0782KL: Type:Thick Film Resistor Resistance:82kΩ Tolerance:±1% Tolerance:±1% Power(Watts):62.5mW Voltage-Supply(Max):50V Temperature Coefficient:±100ppm/℃ Temperature Coefficient:±100ppm/℃ Operating Temperature:-55℃~+155℃ Operating Temperature:-55℃~+155℃; LCSC Part Name: 厚膜电阻 82kΩ ±1% 62.5mW; Supplier Part: C137932; Manufacturer: YAGEO(国巨); Supplier Footprint: 0402; JLCPCB Part Class: Extended Part; Datasheet: https://item.szlcsc.com/datasheet/RC0402FR-0782KL/149248.html; Supplier: LCSC; Type: Thick Film Resistor; Tolerance: ±1%; Power(Watts): 62.5mW; Voltage-Supply(Max): 50V; Temperature Coefficient: ±100ppm/℃; Operating Temperature: -55℃~+155℃; nameAlias: Value(Ω); Contributor: LCEDA_Lib; spicePre: R; spiceSymbolName: R_0603_US
R6 R7 R11 = RC0402FR-075K1L: Type:Thick Film Resistor Resistance:5.1kΩ Tolerance:±1% Tolerance:±1% Power(Watts):62.5mW Voltage-Supply(Max):50V Temperature Coefficient:±100ppm/℃ Temperature Coefficient:±100ppm/℃ Operating Temperature:-55℃~+155℃ Operating Temperature:-55℃~+155℃; LCSC Part Name: 厚膜电阻 5.1kΩ ±1% 62.5mW; Supplier Part: C105872; Manufacturer: YAGEO(国巨); Supplier Footprint: 0402; JLCPCB Part Class: Extended Part; Datasheet: https://item.szlcsc.com/datasheet/RC0402FR-075K1L/107087.html; Supplier: LCSC; Type: Thick Film Resistor; Tolerance: ±1%; Power(Watts): 62.5mW; Voltage-Supply(Max): 50V; Temperature Coefficient: ±100ppm/℃; Operating Temperature: -55℃~+155℃; nameAlias: Value(Ω); Contributor: LCEDA_Lib; spicePre: R; spiceSymbolName: R_0603_US
R14 = RC0402FR-0756KL: Type:Thick Film Resistor Resistance:56kΩ Tolerance:±1% Tolerance:±1% Power(Watts):62.5mW Voltage-Supply(Max):50V Temperature Coefficient:±100ppm/℃ Temperature Coefficient:±100ppm/℃ Operating Temperature:-55℃~+155℃ Operating Temperature:-55℃~+155℃; LCSC Part Name: 厚膜电阻 56kΩ ±1% 62.5mW; Supplier Part: C114756; Manufacturer: YAGEO(国巨); Supplier Footprint: 0402; JLCPCB Part Class: Extended Part; Datasheet: https://item.szlcsc.com/datasheet/RC0402FR-0756KL/116000.html; Supplier: LCSC; Type: Thick Film Resistor; Tolerance: ±1%; Power(Watts): 62.5mW; Voltage-Supply(Max): 50V; Temperature Coefficient: ±100ppm/℃; Operating Temperature: -55℃~+155℃; nameAlias: Value(Ω); Contributor: LCEDA_Lib; spicePre: R; spiceSymbolName: R_0603_US
R16 = RC0603FR-070RL: Type:Thick Film Resistors Resistance:0Ω Tolerance:±1% Tolerance:±1% Power(Watts):100mW Voltage-Supply(Max):75V Temperature Coefficient:- Temperature Coefficient:- Operating Temperature:-55℃~+155℃ Operating Temperature:-55℃~+155℃; LCSC Part Name: 厚膜电阻 0Ω ±1% 100mW; Supplier Part: C100044; Manufacturer: YAGEO(国巨); Supplier Footprint: 0603; JLCPCB Part Class: Extended Part; Datasheet: https://item.szlcsc.com/datasheet/RC0603FR-070RL/101258.html; Supplier: LCSC; Type: Thick Film Resistors; Tolerance: ±1%; Power(Watts): 100mW; Voltage-Supply(Max): 75V; Operating Temperature: -55℃~+155℃; nameAlias: Value(Ω); Contributor: LCEDA_Lib; spicePre: R; spiceSymbolName: R_0603_EU
SW3 = EVQP7C01P: Circuit:SPST Actuator Style:Rectangle button Operating Force:2.2N Mounting Style:卧贴 Switch Length:3.5mm Switch Width:3.55mm Switch Height:1.35mm Contact Current:50mA Voltage Rating (AC):- Voltage Rating (DC):12V Power Rating:- Insulation Resistance:100MΩ; LCSC Part Name: 3.5*3.55*1.35mm 卧贴 轻触开关; Supplier Part: C388883; Manufacturer: PANASONIC(松下); Supplier Footprint: SMD,3.5x3.6mm; JLCPCB Part Class: Extended Part; Datasheet: https://atta.szlcsc.com/upload/public/pdf/source/20190506/C388883_A5E4BA03FED0A1E844D1BD5795C4E105.pdf; Supplier: LCSC; Circuit: SPST; Actuator Style: Rectangle button; Operating Force: 2.2N; Mounting Style: 卧贴; Switch Length: 3.5mm; Switch Width: 3.55mm; Switch Height: 1.35mm; Contact Current: 50mA; Voltage Rating (DC): 12V; Insulation Resistance: 100MΩ; Pin Style: Solder Lug; Mechanical Life: 10万次; Operating Temperature: -20℃~+70℃
U4 = BQ24075RGTR: Supplier: LCSC; Manufacturer: TI(德州仪器); Supplier Part: C15464; JLCPCB Part Class: Extended Part; spicePre: U
U5 = TPS22919DCKR: Supplier: LCSC; Supplier Part: C2149796; Manufacturer: TI(德州仪器); JLCPCB Part Class: Extended Part; Contributor: LCSC; spicePre: U
U6 = TPS63802DLAR: Supplier: LCSC; Supplier Part: C2845237; Manufacturer: TI(德州仪器); JLCPCB Part Class: Extended Part; Contributor: LCSC; spicePre: U
U7 = ATTINY13A-SSU: CPU Core:AVR CPU Maximum Speed:20MHz Program Storage Size:1KB Number of I/O:6 ADC (Bit):10bit Voltage - Supply:1.8V~5.5V Voltage - Supply:1.8V~5.5V Applications:-; Supplier Part: C14075; Manufacturer: MICROCHIP(美国微芯); Supplier Footprint: SOIC-8; JLCPCB Part Class: Extended Part; Datasheet: https://item.szlcsc.com/datasheet/ATTINY13A-SSU/14732.html; Supplier: LCSC; CPU Core: AVR; CPU Maximum Speed: 20MHz; Program Storage Size: 1KB; Number of I/O: 6; ADC (Bit): 10bit; Voltage - Supply: 1.8V~5.5V; Contributor: artal.sa.de; spicePre: U
X2 = ISP pads: Contributor: muhametdinovbulat28; spicePre: U

## Nets
3V3: C1.2 C2.2 C3.2 C4.2 C11.1 C17.2 C18.2 C19.2 C22.2 C23.2 C29.1 FB1.1 R2.2 R3.1 R9.1 R14.2 R17.1 R30.1 SW1.2 SW1.3 U1.1(VBAT) U1.24(VDD) U1.36(VDD) U1.48(VDD) U3.3(WP#(IO2)) U3.7(HOLD#/RESET#(IO3)) U3.8(VCC) U5.3(ON) U6.6(VOUT) U8.6(VDD) U9.4(ANODE4) U9.10(VCC10) U9.11(VCC) X1.6(VCC)
+5V: C12.2 C13.2 D1.1(C) D2.5(VBUS) J1.A4B9(VBUS) J1.B4A9(VBUS) R4.2 U4.6(EN1) U4.13(IN)
GND: C1.1 C2.1 C3.1 C4.1 C5.1 C6.2 C7.2 C8.1 C9.1 C10.1 C11.2 C12.1 C13.1 C14.1 C15.2 C16.1 C17.1 C18.1 C19.1 C20.1 C21.1 C22.1 C23.1 C24.1 C26.1 C27.2 C28.1 C29.2 D1.2(A) D2.2(GND) J1.1(EH) J1.2(EH) J1.3(EH) J1.4(EH) J1.A1B12(GND) J1.B1A12(GND) J2.1 J2.3 J2.4 J3.3 J3.4 O1.1 O2.1 O3.1 O4.1 Q1.2(E) R1.2 R5.1 R6.2 R7.2 R8.1 R10.1 R11.1 R13.1 R15.1 R16.1 R21.1 R23.2 R28.2 SW1.5(GND) SW1.6(GND) SW2.2 SW2.3 SW2.5(GND) SW2.6(GND) SW3.2 SW3.2` SW4.2 SW5.2 SW6.2 SW7.2 SW8.5(COM) SW8.7 SW8.8 U1.8(VSSA/VREF-) U1.23(VSS) U1.35(VSS) U1.47(VSS) U1.49(PAD) U2.2(GND) U2.4(GND) U3.4(GND) U3.9(EP) U4.4(#CE) U4.5(EN2) U4.8(VSS) U4.15(SYSOFF) U4.17(EP) U5.2(GND) U6.3(AGND) U6.8(GND) U7.4(GND) U8.7(GND) U9.2(GND2) U9.5(GND) U9.13(GND13) X1.1(GND) X2.1(GND)
VBAT: C15.1 J2.2 U4.2(BAT) U4.3(BAT) U5.1(IN)
VBUS: R4.1 R5.2 U1.30(PA9)
+V: C14.2 C16.2 C20.2 C21.2 R19.1 U4.10(OUT) U4.11(OUT) U6.10(VIN) U7.8(VCC) X2.6(VCC)
A_BTN: SW7.1 U1.26(PB13)
AMP_SD: R23.1 U1.20(PB2) U8.1(SD#)
AUDIO_PWM: R24.1 U1.29(PA8)
B_BTN: SW6.1 U1.27(PB14)
BAT_STAT: R12.1 R13.2 U1.11(PA1)
BLK: R27.1 U1.16(PA6)
BOOT0: R1.1 SW1.1 SW1.4 U1.44(BOOT0)
CE_BTN: SW8.2(CEN) U1.31(PA10)
CHRG_STAT: R9.2 U1.10(PA0) U4.9(#CHG)
CS_D: R30.2 U1.14(PA4) U9.12(CS12)
CS_F: R3.2 U1.38(PA15) U3.1(CS#)
D+: D2.1(I/O1) U1.33(PA12)
D-: D2.3(I/O2) U1.32(PA11)
DC: U1.18(PB0) U9.7(DC7)
DN: D2.4(I/O2) J1.A7(DN1) J1.B7(DN2)
DOWN_BTN: SW8.6(B) U1.45(PB8)
DP: D2.6(I/O1) J1.A6(DP1) J1.B6(DP2)
EN: R21.2 U6.1(EN) U7.3(PB4)
ISP_MISO: U7.6(PB1) X2.3(MISO)
ISP_MOSI: R22.2 U7.5(PB0) X2.2(MOSI)
ISP_RST: R19.2 U7.1(PB5) X2.5(RESET)
ISP_SCK: R20.1 U7.7(PB2) X2.4(SCK)
LEFT_BTN: SW8.3(C) U1.43(PB7)
MISO_F: U1.40(PB4) U3.2(DO(IO1))
MOSI_D: U1.17(PA7) U9.8(MOSI)
MOSI_F: U1.41(PB5) U3.5(DI(IO0))
NRST: C10.2 R2.1 SW2.1 SW2.4 U1.7(NRST) X1.2(NRST)
OFF_ACK: R20.2 U1.13(PA3)
OFF_REQ: R17.2 R18.2 U1.12(PA2)
OSC_IN: C7.1 U1.5(PH0-OSC_IN) U2.1
OSC_OUT: C8.2 U1.6(PH1-OSC_OUT) U2.3
PWR_BTN: R22.1 SW3.1 SW3.1`
RIGHT_BTN: SW8.4(D) U1.42(PB6)
RST_D: U1.19(PB1) U9.6(RST6)
SCK_D: U1.15(PA5) U9.9(SCK)
SCK_F: U1.39(PB3) U3.6(CLK)
SWCLK: U1.37(PA14) X1.3(SWCLK)
SWDIO: U1.34(PA13) X1.4(SWDIO)
UP_BTN: SW8.1(A) U1.46(PB9)
VCAP: C9.2 U1.22(VCAP1)
VDDA/VREF+: C5.2 C6.1 FB1.2 U1.9(VDDA/VREF+)
X_BTN: SW5.1 U1.25(PB12)
Y_BTN: SW4.1 U1.28(PB15)
$2N4: R14.1 R15.2 U6.4(FB)
$2N16: L1.1 U6.9(L1)
$2N17: L1.2 U6.7(L2)
$2N28: R11.2 U4.16(ISET)
$2N60: R18.1 U7.2(PB3)
$2N62: R16.2 U6.2(MODE)
$2N64: R12.2 U5.5(QOD) U5.6(VOUT)
$2N975: R8.2 U4.1(TS)
$2N6281: R10.2 U4.12(ILIM)
$3N1049: Q1.3(C) R29.1
$3N1051: Q1.1(B) R27.2 R28.1
$3N1059: FB2.1 U8.5(VO+)
$3N1060: FB3.1 U8.8(VO-)
$3N1072: C24.2 C25.1 R24.2
$3N1073: C26.2 R26.1
$3N1074: C25.2 R25.1
$3N1075: R25.2 U8.4(IN-)
$3N1076: R26.2 U8.3(IN+)
Net-(C27-1): C27.1 FB3.2 J3.1
Net-(C28-2): C28.2 FB2.2 J3.2
Net-(J1-A5): J1.A5(CC1) R7.1
Net-(J1-B5): J1.B5(CC2) R6.1
Net-(R29-2): R29.2 U9.3(CATH3)

Not connected (* = marked no-connect by the designer): J1 A8(SBU1)* B8(SBU2)*; U1 2(PC13)* 3(PC14/OSC32IN)* 4(PC15/OSC32OUT)* 21(PB10)*; U4 7(#PGOOD)* 14(TMR)*; U5 4(NC)*; U6 5(PG)*; U8 2(NC)*; U9 1(NC1)* 14(NC14)*; X1 5(SWO)*

## Notes on the sheets
sheet 1
- STM32F411CEU6 MCU
- W25Q128JVPIQ 16Mb External FLASH
- C7=C8=2(CL-CS)=2*(12 - 5) = 14 ~ 15pF
- Logic
- 0.1
- HSE MIEM
- 1/3
- 31.05.2026
- brmukhametdinov
sheet 2
- TYPE-C CONNECTOR
- POWER-PATH CHARGER BQ24075
- LP233350 310mAh connector
- AN4879 reference
- USB500:
- EN1=1
  EN2=0
- ON-OFF CONTROLLER ATTINY13A
- Ichrg=890/R11=175mA
- BUCK-BOOST CONVERTER TPS63802
- R14 = R15*(VOUT/VFB - 1) =
  = R15*(3.3/0.5 - 1) =
  = 5.6*R15
- Power supply
- 0.1
- HSE MIEM
- 2/3
- 31.05.2026
- brmukhametdinov
sheet 3
- PAM8302AASCR AMPLIFIER
- RIGHT Button Block
- KAN0444-0201B/102
- 5-WAY DISCRETE JOYSTICK
- ST7735S 1.8" TFT
- SKRHABE010
- Input/Output interfaces
- 0.1
- HSE MIEM
- 3/3
- 31.05.2026
- brmukhametdinov
